# EAGLE design OLED_096_SH1101A_main (EAGLE 6.0)

## Sheet 1 of 2
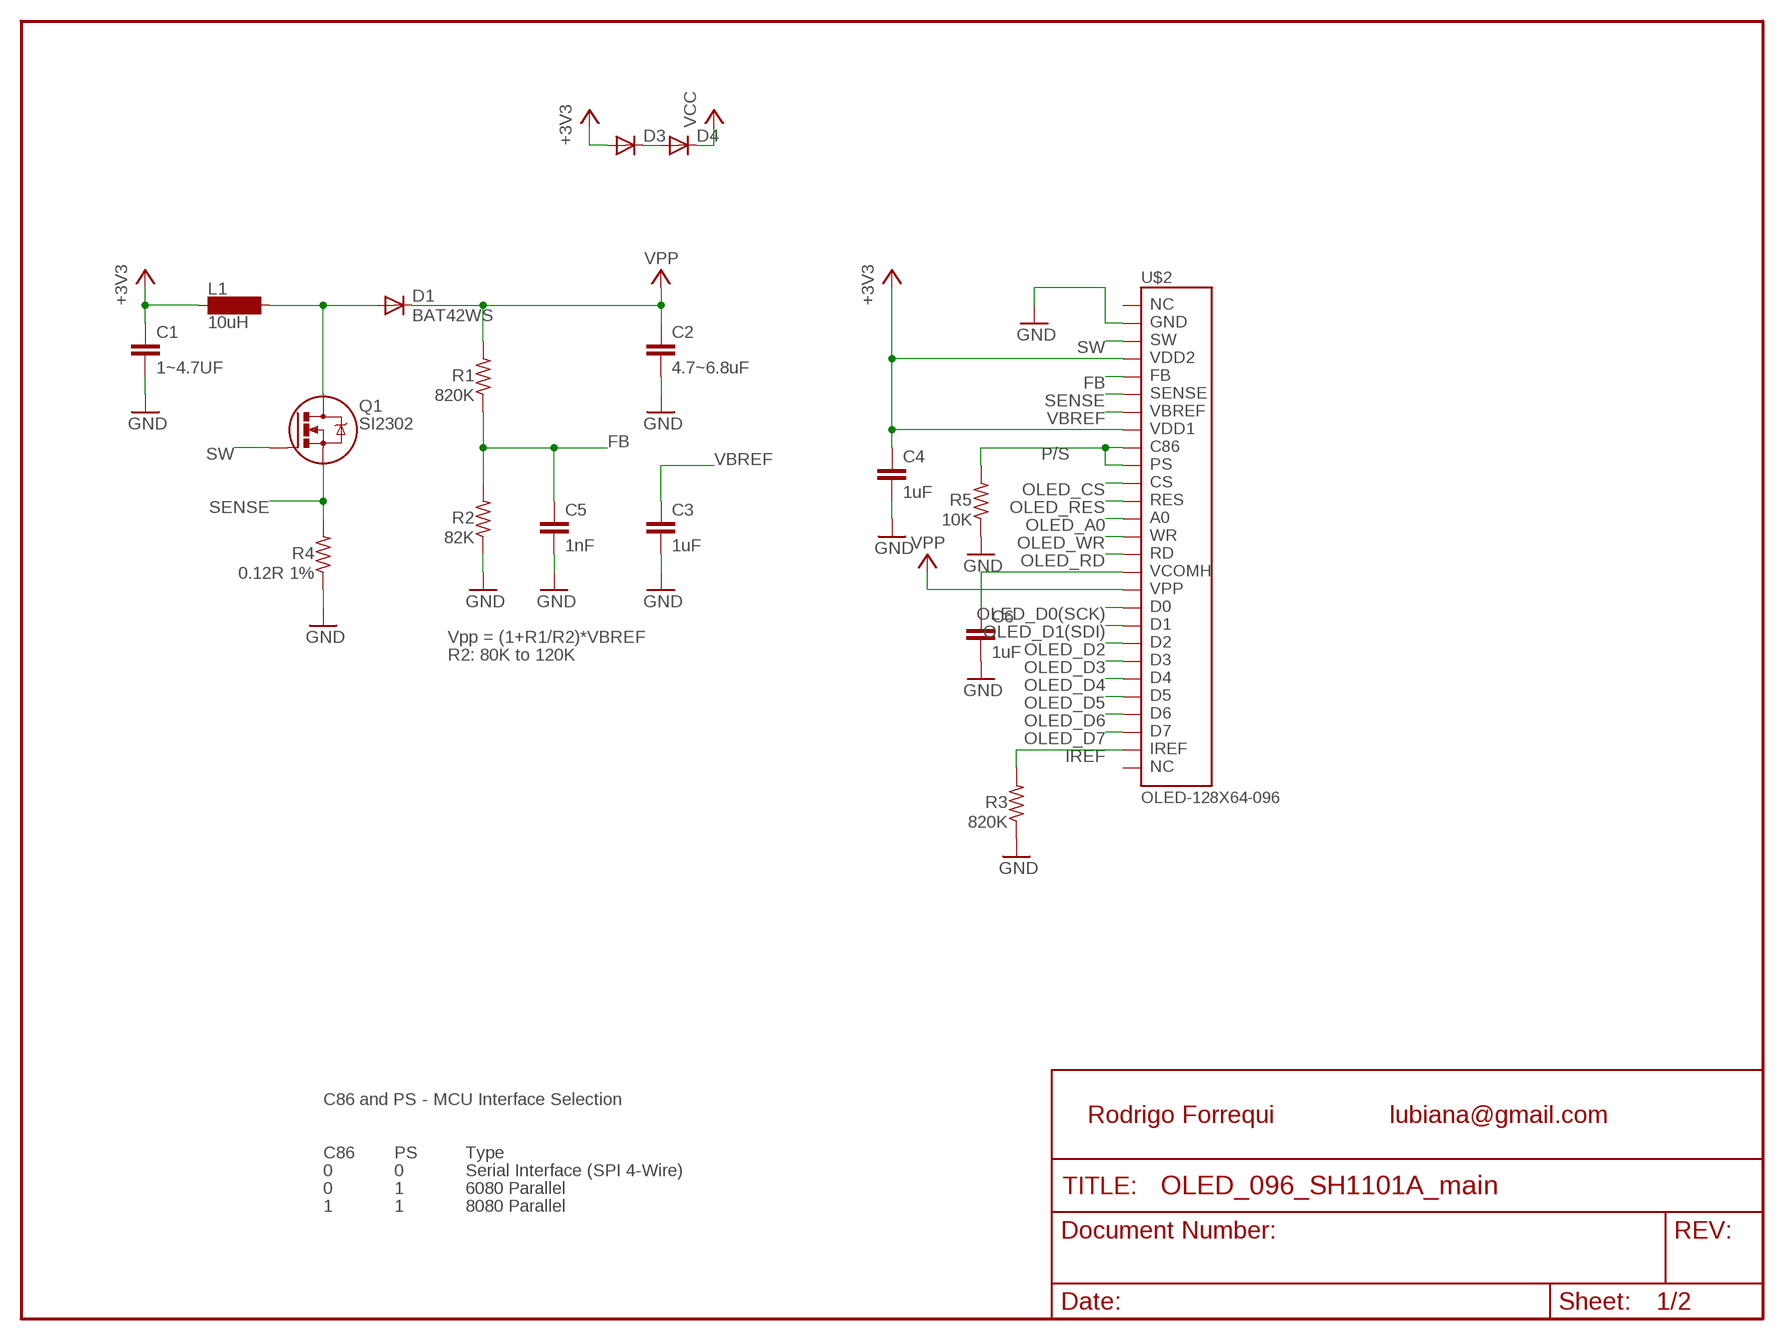
[diagram p0: schematic, sheet 1]

### Parts
C1  1~4.7UF  C-EUC0805  [C0805]
C2  4.7~6.8uF  C-EUC0805  [C0805]
C3  1uF  C-EUC0805  [C0805]
C4  1uF  C-EUC0805  [C0805]
C5  1nF  C-EUC0805  [C0805]
C6  1uF  C-EUC0805  [C0805]
D1  BAT42WS  DIODESOD  [SOD-323]
D3  DIODE-MINIMELF  [MINIMELF]
D4  DIODE-MINIMELF  [MINIMELF]
L1  10uH  LPO4812  [LPO4812]
Q1  SI2302  MOSFET-NCHANNELSMD  [SOT23-3]
R1  820K  R-US_R0805  [R0805]
R2  82K  R-US_R0805  [R0805]
R3  820K  R-US_R0805  [R0805]
R4  0.12R 1%  R-US_M1206  [M1206]
R5  10K  R-US_R0805  [R0805]
U$2  OLED-128X64-096  [UG-2864AMBAG01]

### Nets
+3V3: C1.1 C4.1 D3.A L1.P$1 U$2.P$4 U$2.P$8
FB: C5.1 R1.1 R2.2 U$2.P$5
GND: C1.2 C2.2 C3.2 C4.2 C5.2 C6.2 R2.1 R3.1 R4.1 R5.1 U$2.P$2 ; also sheet 2
IREF: R3.2 U$2.P$26
N$2: D1.2(A) L1.P$2 Q1.3(D)
N$3: C6.1 U$2.P$16
N$15: D3.C D4.A
OLED_A0: U$2.P$13 ; also sheet 2
OLED_CS: U$2.P$11 ; also sheet 2
OLED_D0(SCK): U$2.P$18 ; also sheet 2
OLED_D1(SDI): U$2.P$19 ; also sheet 2
OLED_D2: U$2.P$20
OLED_D3: U$2.P$21
OLED_D4: U$2.P$22
OLED_D5: U$2.P$23
OLED_D6: U$2.P$24
OLED_D7: U$2.P$25
OLED_RD: U$2.P$15
OLED_RES: U$2.P$12 ; also sheet 2
OLED_WR: U$2.P$14
P/S: R5.2 U$2.P$9 U$2.P$10
SENSE: Q1.2(S) R4.2 U$2.P$6
SW: Q1.1(G) U$2.P$3
VBREF: C3.1 U$2.P$7
VCC: C2.1 D1.1(C) D4.C R1.2 U$2.P$17 ; supply symbol labelled VPP ; also sheet 2
Unconnected: U$2.P$1 U$2.P$27

### Notes on the sheet
- Vpp = (1+R1/R2)*VBREF
- R2: 80K to 120K
- C86 and PS - MCU Interface Selection
- Rodrigo Forrequi | lubiana@gmail.com
- C86 | PS | Type
- 0 | 0 | Serial Interface (SPI 4-Wire)
- 0 | 1 | 6080 Parallel
- 1 | 1 | 8080 Parallel

## Sheet 2 of 2
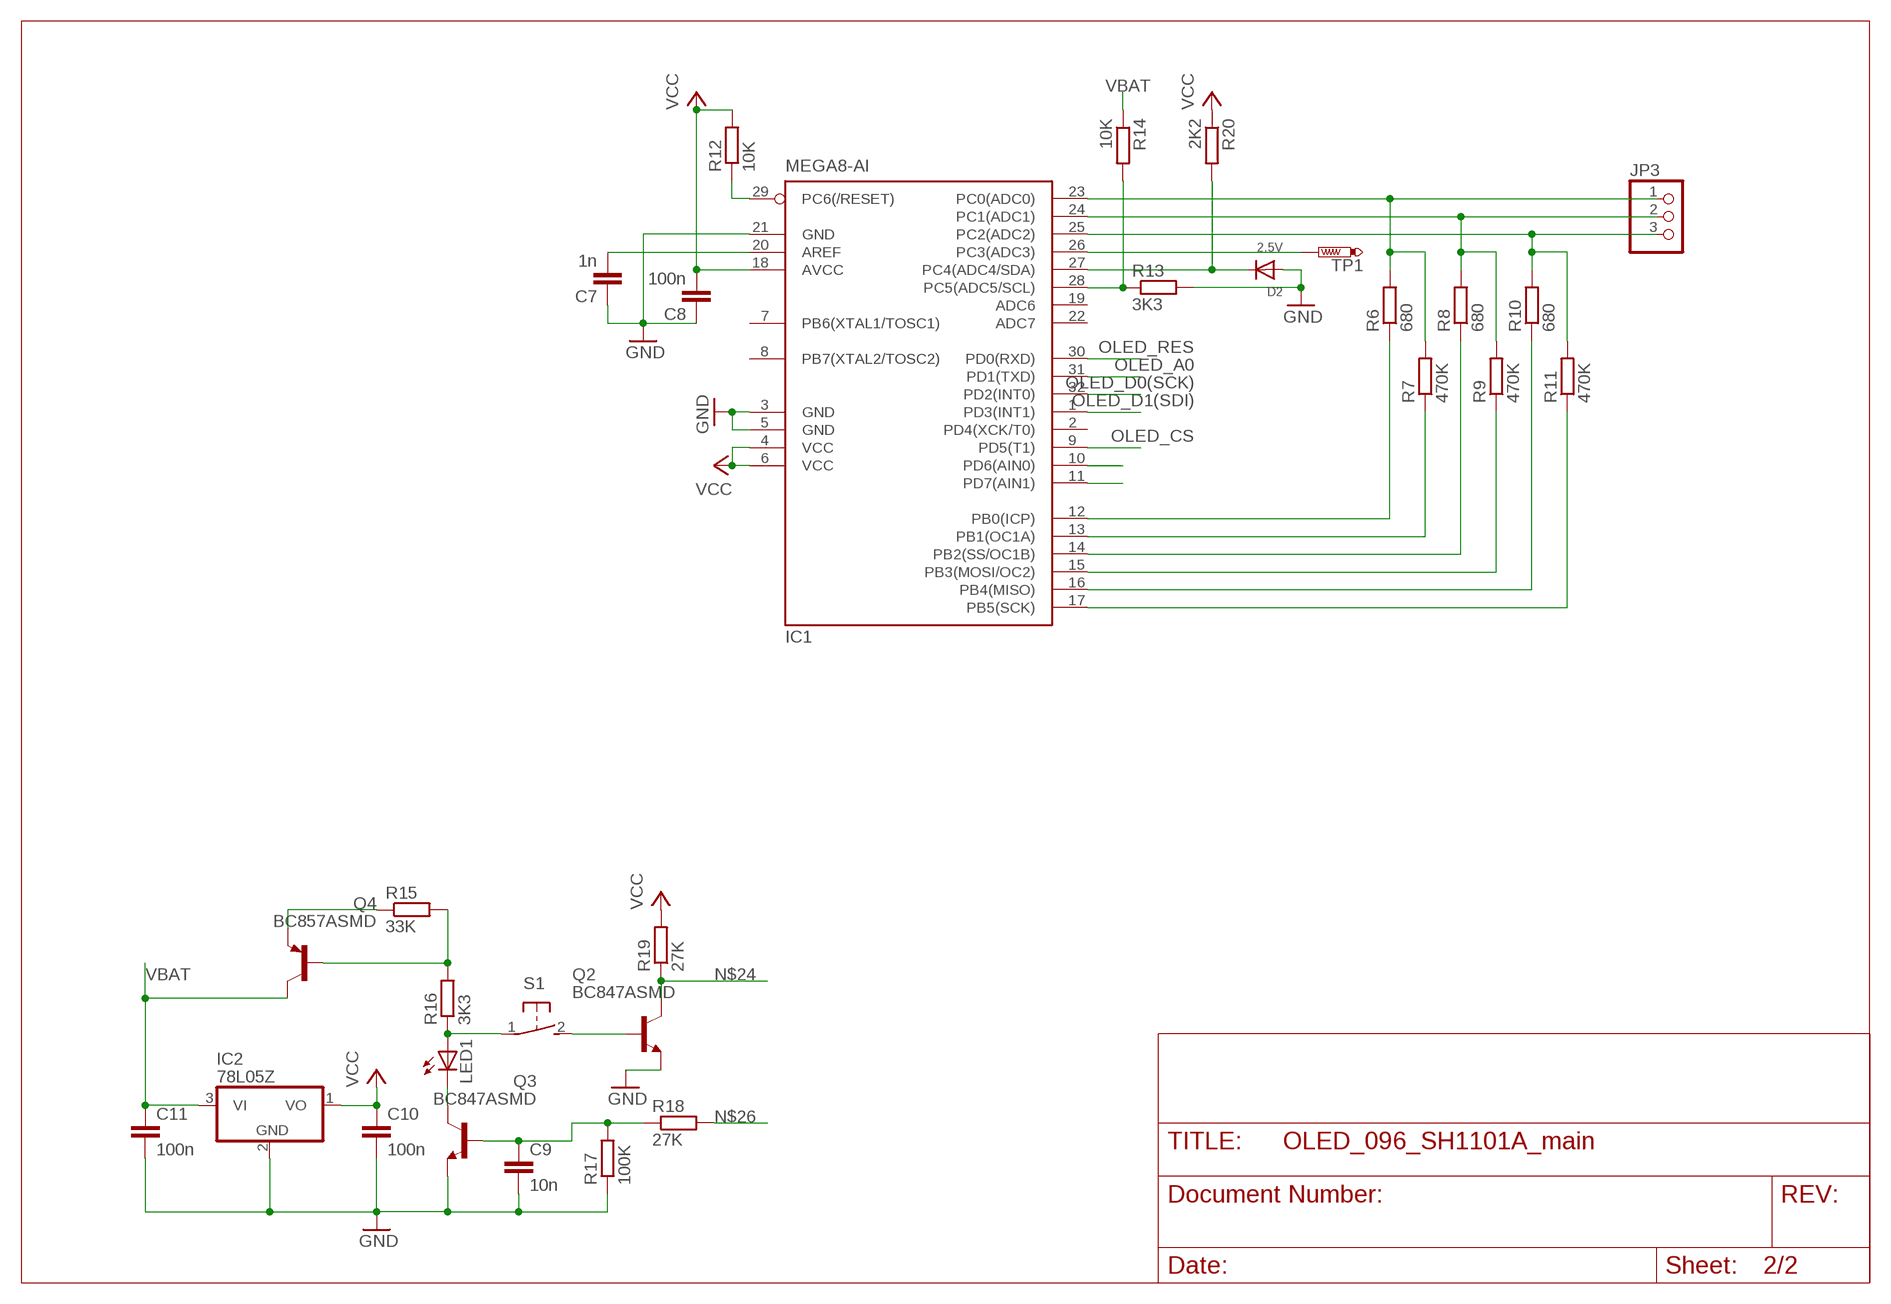
[diagram p1: schematic, sheet 2]

### Parts
C7  1n  C-EUC0805  [C0805]
C8  100n  C-EUC0805  [C0805]
C9  10n  C-EUC0805  [C0805]
C10  100n  C-EUC0805  [C0805]
C11  100n  C-EUC0805  [C0805]
D2  2.5V  DIODESOD-523  [SOD-523]
IC1  MEGA8-AI  [TQFP32-08]
IC2  78L05Z  [TO92]
JP3  PINHD-1X3  [1X03]
LED1  LEDSML0603  [SML0603]
Q2  BC847ASMD  [SOT23]
Q3  BC847ASMD  [SOT23]
Q4  BC857ASMD  [SOT23-BEC]
R6  680  R-EU_R0805  [R0805]
R7  470K  R-EU_R0805  [R0805]
R8  680  R-EU_R0805  [R0805]
R9  470K  R-EU_R0805  [R0805]
R10  680  R-EU_R0805  [R0805]
R11  470K  R-EU_R0805  [R0805]
R12  10K  R-EU_R0805  [R0805]
R13  3K3  R-EU_R0805  [R0805]
R14  10K  R-EU_R0805  [R0805]
R15  33K  R-EU_R0805  [R0805]
R16  3K3  R-EU_R0805  [R0805]
R17  100K  R-EU_R0805  [R0805]
R18  27K  R-EU_R0805  [R0805]
R19  27K  R-EU_R0805  [R0805]
R20  2K2  R-EU_R0805  [R0805]
S1  31-XX  [B3F-31XX]
TP1  PTR1B1,27  [B1,27]

### Nets
GND: C7.1 C8.1 C9.2 C10.2 C11.2 D2.A IC1.3(GND) IC1.5(GND) IC1.21(GND) IC2.2(GND) Q2.2(E) Q3.2(E) R13.2 R17.1 ; also sheet 1
N$1: IC1.23(PC0(ADC0)) JP3.1 R6.2 R7.2
N$4: IC1.24(PC1(ADC1)) JP3.2 R8.2 R9.2
N$5: IC1.25(PC2(ADC2)) JP3.3 R10.2 R11.2
N$6: IC1.12(PB0(ICP)) R6.1
N$7: IC1.13(PB1(OC1A)) R7.1
N$8: IC1.14(PB2(SS/OC1B)) R8.1
N$9: IC1.15(PB3(MOSI/OC2)) R9.1
N$10: IC1.16(PB4(MISO)) R10.1
N$11: IC1.17(PB5(SCK)) R11.1
N$12: C7.2 IC1.20(AREF)
N$13: IC1.28(PC5(ADC5/SCL)) R13.1 R14.2
N$14: IC1.29(PC6(/RESET)) R12.1
N$16: D2.K(C) IC1.27(PC4(ADC4/SDA)) R20.2
N$17: IC1.26(PC3(ADC3)) TP1.TP
N$18: C9.1 Q3.1(B) R17.2 R18.1
N$19: LED1.A R16.1 S1.1(P)
N$20: LED1.C Q3.3(C)
N$21: Q2.1(B) S1.2(S)
N$22: Q4.B R15.2 R16.2
N$23: Q4.E R15.1
N$24: IC1.11(PD7(AIN1)) Q2.3(C) R19.1
N$26: IC1.10(PD6(AIN0)) R18.2
OLED_A0: IC1.31(PD1(TXD)) ; also sheet 1
OLED_CS: IC1.9(PD5(T1)) ; also sheet 1
OLED_D0(SCK): IC1.32(PD2(INT0)) ; also sheet 1
OLED_D1(SDI): IC1.1(PD3(INT1)) ; also sheet 1
OLED_RES: IC1.30(PD0(RXD)) ; also sheet 1
VBAT: C11.1 IC2.3(VI) Q4.C R14.1
VCC: C8.2 C10.1 IC1.4(VCC) IC1.6(VCC) IC1.18(AVCC) IC2.1(VO) R12.2 R19.2 R20.1 ; also sheet 1
Unconnected: IC1.2(PD4(XCK/T0)) IC1.7(PB6(XTAL1/TOSC1)) IC1.8(PB7(XTAL2/TOSC2)) IC1.19(ADC6) IC1.22(ADC7)

## Library data of the parts
C1-C6 = rcl:C-EU: CAPACITOR, European symbol
C7-C11 = resistor:C-EU: CAPACITOR, European symbol
D1 = Forrequi:DIODE: Diode
D2 = adafruit:DIODE: Diode
D3 D4 = diode:DIODE-: DIODE
IC1 = atmel:MEGA8: MICROCONTROLLER 8 Kbytes FLASH, 1 kbytes SRAM, 512 bytes EEPROM, USART, 6-channel 10 bit ADC, 2-channel 8 bit ADC Pin compatible with Atmega48, ATMega88, ATMega168 Source: avr.lbr; MPN: ATMEGA8-16AU; OC_FARNELL: 9171371; OC_NEWARK: 73M8863
IC2 = linear:78*: Positive VOLTAGE REGULATOR Source: http://cache.national.com/ds/LM/LM78L05.pdf http://www.fairchildsemi.com/ds/LM/LM7805.pdf
JP3 = pinhead:PINHD-1X3: PIN HEADER
L1 = Forrequi:LPO4812: Coilcraft inductor LPO4812 Datasheet and info at: http://www.coilcraft.com/lpo4812.cfm
LED1 = led:LED: LED OSRAM: - CHIPLED LG R971, LG N971, LY N971, LG Q971, LY Q971, LO R971, LY R971 LH N974, LH R974 LS Q976, LO Q976, LY Q976 LO Q996 - Hyper CHIPLED LW Q18S LB Q993, LB Q99A, LB R99A - SideLED LS A670, LO A670, LY A670, LG A670, LP A670 LB A673, LV A673, LT A673, LW A673 LH A674 LY A675 LS A676, LA A676, LO A676, LY A676, LW A676 LS A679, LY A679, LG A679 - Hyper Micro SIDELED® LS Y876, LA Y876, LO Y876, LY Y876 LT Y87S - SmartLED LW L88C, LW L88S LB L89C, LB L89S, LG L890 LS L89K, LO L89K, LY L89K LS L896, LA L896, LO L896, LY L896 - TOPLED LS T670, LO T670, LY T670, LG T670, LP T670 LSG T670, LSP T670, LSY T670, LOP T670, LYG T670 LG T671, LOG T671, LSG T671 LB T673, LV T673, LT T673, LW T673 LH T674 LS T676, LA T676, LO T676, LY T676, LB T676, LH T676, LSB T676, LW T676 LB T67C, LV T67C, LT T67C, LS T67K, LO T67K, LY T67K, LW E67C LS E67B, LA E67B, LO E67B, LY E67B, LB E67C, LV E67C, LT E67C LW T67C LS T679, LY T679, LG T679 LS T770, LO T770, LY T770, LG T770, LP T770 LB T773, LV T773, LT T773, LW T773 LH T774 LS E675, LA E675, LY E675, LS T675 LS T776, LA T776, LO T776, LY T776, LB T776 LHGB T686 LT T68C, LB T68C - Hyper Mini TOPLED® LB M676 - Mini TOPLED Santana® LG M470 LS M47K, LO M47K, LY M47K Source: http://www.osram.convergy.de LUXEON: - LUMILED® LXK2-PW12-R00, LXK2-PW12-S00, LXK2-PW14-U00, LXK2-PW14-V00 LXK2-PM12-R00, LXK2-PM12-S00, LXK2-PM14-U00 LXK2-PE12-Q00, LXK2-PE12-R00, LXK2-PE12-S00, LXK2-PE14-T00, LXK2-PE14-U00 LXK2-PB12-K00, LXK2-PB12-L00, LXK2-PB12-M00, LXK2-PB14-N00, LXK2-PB14-P00, LXK2-PB14-Q00 LXK2-PR12-L00, LXK2-PR12-M00, LXK2-PR14-Q00, LXK2-PR14-R00 LXK2-PD12-Q00, LXK2-PD12-R00, LXK2-PD12-S00 LXK2-PH12-R00, LXK2-PH12-S00 LXK2-PL12-P00, LXK2-PL12-Q00, LXK2-PL12-R00 Source: www.luxeon.com KINGBRIGHT: KA-3528ASYC Source: www.kingbright.com
Q1 = Forrequi:MOSFET-NCHANNEL
Q2 Q3 = transistor-npn:BC847*: NPN Transistor
Q4 = transistor-pnp:BC857*: PNP Transistror
R1-R5 = rcl:R-US_: RESISTOR, American symbol
R6-R20 = resistor:R-EU_: RESISTOR, European symbol
S1 = switch-omron:31-XX: OMRON SWITCH; MPN: B3F-3100; OC_FARNELL: 959704; OC_NEWARK: 36M3582
TP1 = testpad:PTR1: TEST PIN
U$2 = Forrequi:OLED-128X64-096

## Board
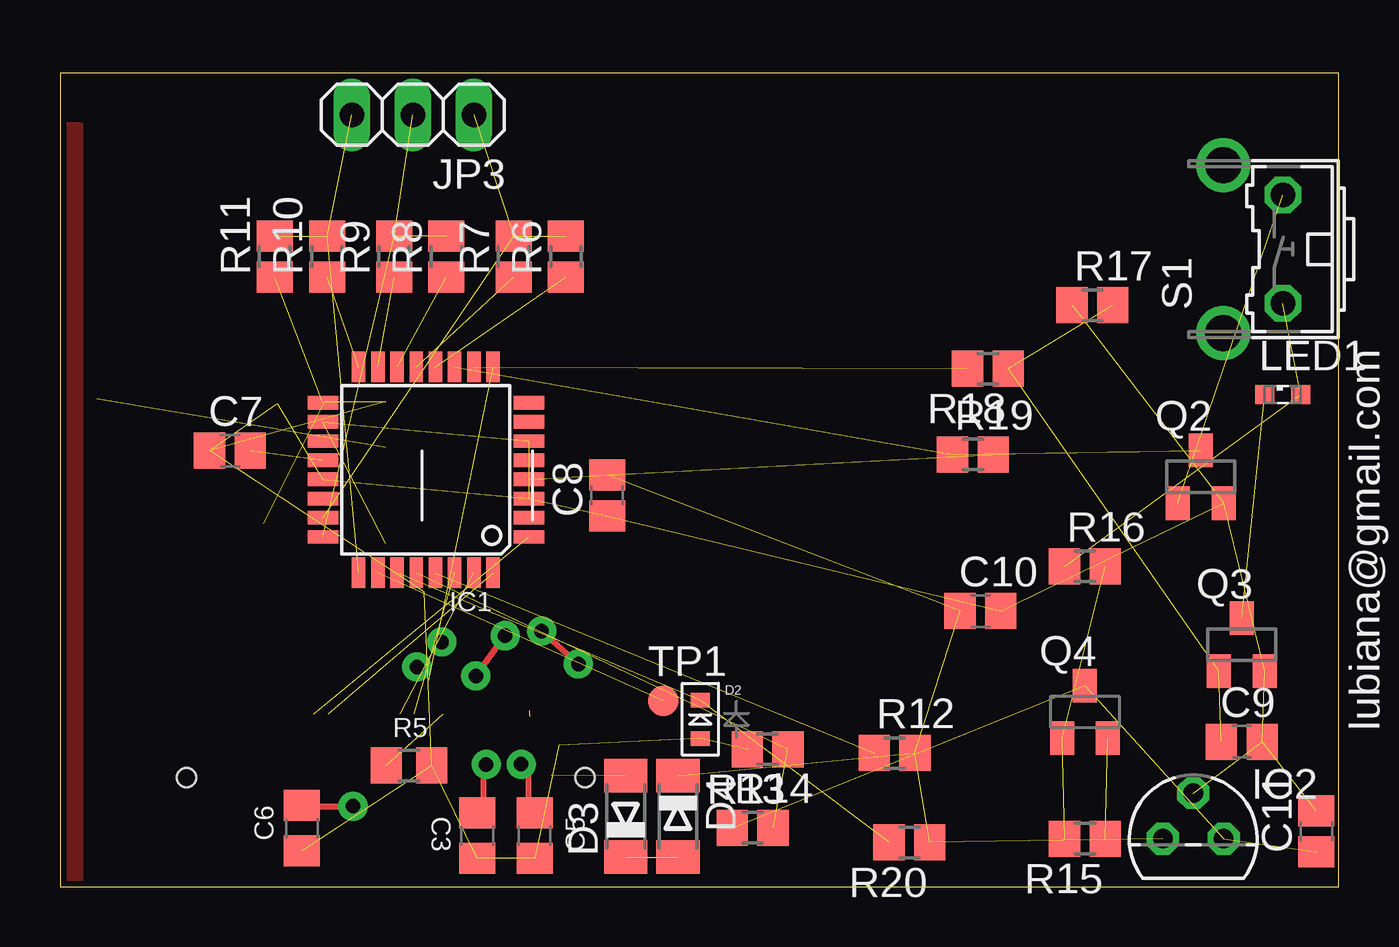
[diagram p2: board, top side]
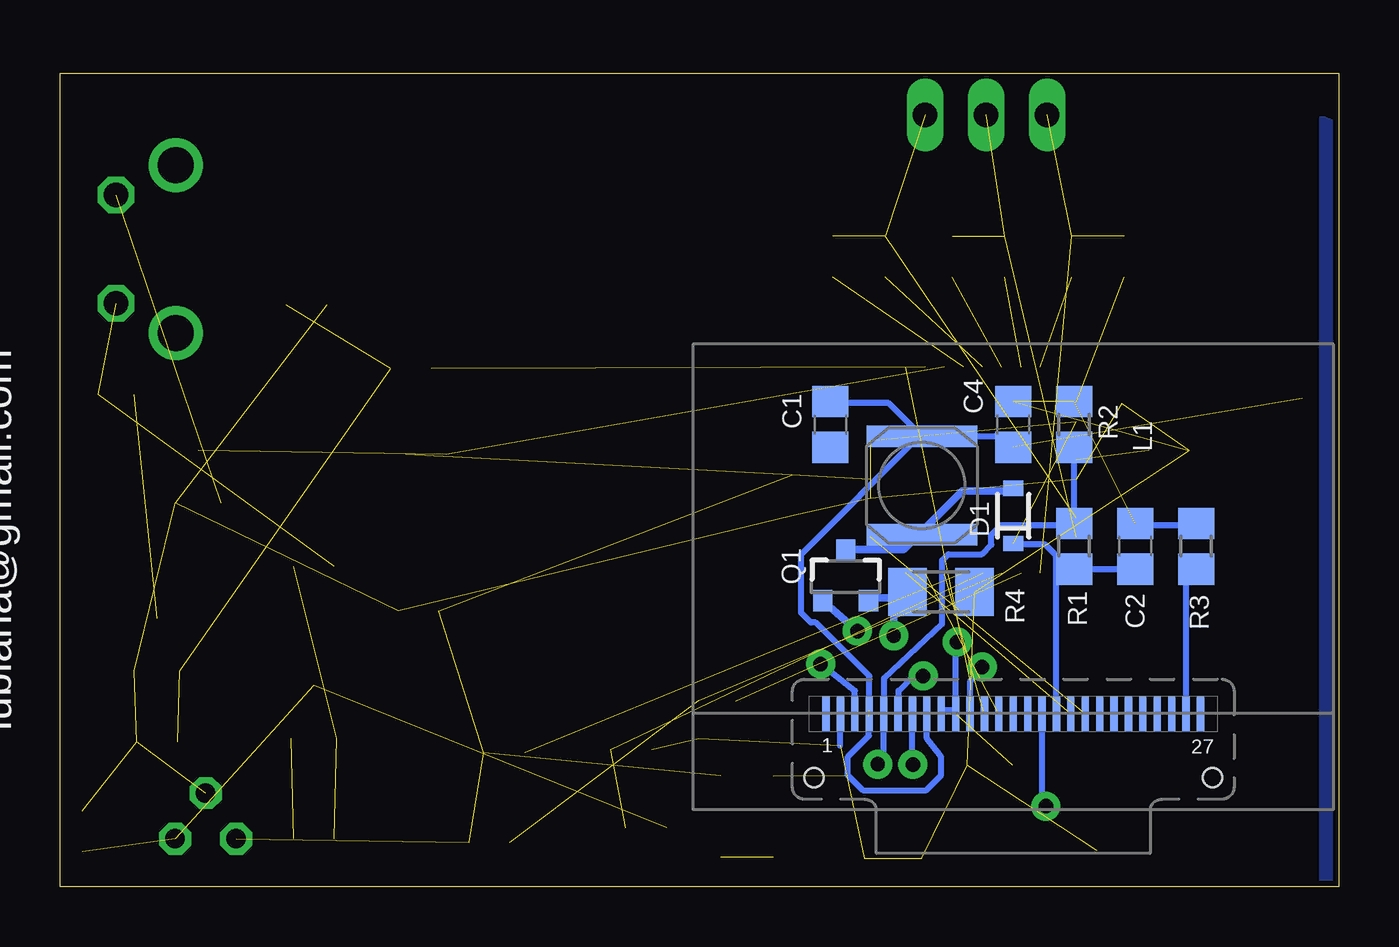
[diagram p3: board, bottom side, seen from below]

Size 53.29 x 33.92 mm. Coordinates in mm from the lower left corner, seen from the top.
Outline: 0,33.92 0,0 53.29,0 53.29,33.92 0,33.92
Copper layers (1*16): Top 0.035mm / dielectric 1.5mm / Bottom 0.035mm
Design rules: minimum track width 10mil, minimum drill 23mil, track to track 8mil, track to pad 8mil, pad to pad 8mil, via to via 8mil, smd to smd 8mil, copper to edge 8mil, drill to drill 10mil, minimum pad ring 10mil, minimum via ring 12mil, stop-mask expansion 4mil, vias tented up to drill 0mil, thermal gap 10mil

### Footprints (pad centres in the part's own frame; a part is rotated, then mirrored left to right if it is on the bottom)
C0805 = smd 1.3 x 1.5: 1 -0.95,0; 2 0.95,0
C0805' = smd 1.3 x 1.5: 1 -0.85,0; 2 0.85,0
SOD-323 = smd 0.63 x 0.83: 1 -1.15,0; 2 1.15,0
SOD-523 = smd 0.8 x 0.6: A 0,-0.8; K 0,0.8
MINIMELF = smd 1.4 x 1.8: A 1.7,0; C -1.7,0
TQFP32-08 = smd 1.27 x 0.559: 1 -4.293,2.8; 2 -4.293,2; 3 -4.293,1.2; 4 -4.293,0.4; 5 -4.293,-0.4; 6 -4.293,-1.2; 7 -4.293,-2; 8 -4.293,-2.8; 17 4.293,-2.8; 18 4.293,-2; 19 4.293,-1.2; 20 4.293,-0.4; 21 4.293,0.4; 22 4.293,1.2; 23 4.293,2; 24 4.293,2.8 | smd 0.559 x 1.27: 9 -2.8,-4.293; 10 -2,-4.293; 11 -1.2,-4.293; 12 -0.4,-4.293; 13 0.4,-4.293; 14 1.2,-4.293; 15 2,-4.293; 16 2.8,-4.293; 25 2.8,4.293; 26 2,4.293; 27 1.2,4.293; 28 0.4,4.293; 29 -0.4,4.293; 30 -1.2,4.293; 31 -2,4.293; 32 -2.8,4.293
TO92 = drill 0.813 octagon: 1 -1.27,0; 2 0,1.905; 3 1.27,0
1X03 = drill 1.016 long: 1 -2.54,0; 2 0,0; 3 2.54,0
LPO4812 = smd 4.6 x 0.89: P$1 0,2.05; P$2 0,-2.05
SML0603 = smd 0.8 x 0.8: A 0.75,0; C -0.75,0
SOT23-3 = smd 0.8 x 0.9: 1 -0.95,-1; 2 0.95,-1; 3 0,1.1
SOT23 = smd 1 x 1.4: 1 -0.95,-1.1; 2 0.95,-1.1; 3 0,1.1
SOT23-BEC = smd 1 x 1.4: B -0.95,-1.1; C 0,1.1; E 0.95,-1.1
R0805 = smd 1.3 x 1.5: 1 -0.95,0; 2 0.95,0
M1206 = smd 1.6 x 2: 1 -1.4,0; 2 1.4,0
R0805' = smd 1.3 x 1.5: 1 -0.85,0; 2 0.85,0
B3F-31XX = drill 1.016 octagon: 1 -2.261,-1.245; 2 2.261,-1.245 | drill 1.499 pad 2.159: 3 -3.505,1.245; 4 3.505,1.245
B1,27 = smd 1.27 x 1.27: TP 0,0
UG-2864AMBAG01 = smd 0.3 x 1.5: P$1 -7.8,-5.72; P$2 -7.2,-5.72; P$3 -6.6,-5.72; P$4 -6,-5.72; P$5 -5.4,-5.72; P$6 -4.8,-5.72; P$7 -4.2,-5.72; P$8 -3.6,-5.72; P$9 -3,-5.72; P$10 -2.4,-5.72; P$11 -1.8,-5.72; P$12 -1.2,-5.72; P$13 -0.6,-5.72; P$14 0,-5.72; P$15 0.6,-5.72; P$16 1.2,-5.72; P$17 1.8,-5.72; P$18 2.4,-5.72; P$19 3,-5.72; P$20 3.6,-5.72; P$21 4.2,-5.72; P$22 4.8,-5.72; P$23 5.4,-5.72; P$24 6,-5.72; P$25 6.6,-5.72; P$26 7.2,-5.72; P$27 7.8,-5.72 | hole 0.8: 8.3,-8.37; -8.3,-8.37

### Placement (x,y rotation side)
C1  21.19,19.28 270 bottom
C2  8.49,14.2 90 bottom
C3  17.39,2.14 270 top
C4  13.57,19.28 90 bottom
C5  19.78,2.14 270 top
C6  10.08,2.45 270 top
C7  1n  [C0805']  7.08,18.19 0 top
C8  100n  [C0805']  22.79,16.32 90 top
C9  10n  [C0805']  49.24,6.05 0 top
C10  100n  [C0805']  38.35,11.5 0 top
C11  100n  [C0805']  52.35,2.32 90 top
D1  13.57,15.47 90 bottom
D2  26.68,6.99 0 top
D3  23.57,2.94 90 top
D4  25.75,2.94 270 top
IC1  15.24,17.39 180 top
IC2  47.22,2.01 0 top
JP3  14.7,32.19 180 top
L1  17.38,16.74 0 bottom
LED1  50.95,20.52 0 top
Q1  20.55,12.93 0 bottom
Q2  47.53,17.1 0 top
Q3  49.24,10.1 0 top
Q4  42.71,7.3 0 top
R1  11.03,14.2 270 bottom
R2  11.03,19.28 270 bottom
R3  5.95,14.2 270 bottom
R4  16.58,12.3 180 bottom
R5  14.54,5.07 180 top
R6  680  [R0805']  21.08,26.28 90 top
R7  470K  [R0805']  18.9,26.28 90 top
R8  680  [R0805']  16.1,26.28 90 top
R9  470K  [R0805']  13.93,26.28 90 top
R10  680  [R0805']  11.13,26.28 90 top
R11  470K  [R0805']  8.95,26.28 90 top
R12  10K  [R0805']  34.77,5.59 0 top
R13  3K3  [R0805']  29.48,5.74 180 top
R14  10K  [R0805']  28.86,2.48 0 top
R15  33K  [R0805']  42.71,2.01 180 top
R16  3K3  [R0805']  42.71,13.37 0 top
R17  100K  [R0805']  43.02,24.26 0 top
R18  27K  [R0805']  38.66,21.61 180 top
R19  27K  [R0805']  38.04,18.03 0 top
R20  2K2  [R0805']  35.39,1.85 180 top
S1  49.71,26.59 90 top
TP1  25.13,7.77 0 top
U$2  13.57,12.93 0 bottom

### Tracks (layer width: path | path; a pad name or v marks a point on that pad's centre or on a via)
+3V3  (4 unrouted)
  Bottom 0.254: L1.P$1 17.33,18.75 | C1.1 21.19,20.17 18.75,20.17 17.53,18.95 L1.P$1 | 19.56,7.37 19.56,8.79 21.8,11.03 22,11.03 22.41,11.43 22.41,13.87 17.53,18.75 L1.P$1 | 13.67,18.34 14.12,18.79 L1.P$1 | 17.19,6.79 U$2.P$8 17.17,6.19 16.57,5.43 16.57,4.65 17.19,4.03 19.84,4.03 20.46,4.65 20.46,5.43 19.59,6.3 19.59,7.1
FB  (via drill 0.6)
  Top 0.254: v19.21,5.12 19.53,4.81 19.53,3.1 19.68,2.94 C5.1
  Bottom 0.254: R2.2 R1.1 11.03,15.09 14.08,15.09 14.48,14.68 14.48,14.28 14.89,13.87 16.28,13.87 16.53,13.62 16.53,10.97 18.95,8.7 18.95,7.23 U$2.P$5 18.97,5.37 v19.21,5.12
GND  (23 unrouted)
  Bottom 0.254: C2.2 8.39,15.09 5.95,15.09 R3.1 | 21.19,18.34 C1.2 21.19,18.14 | 20.78,5.9 20.78,7.17 U$2.P$2
  pour Bottom (isolate 0.254): 0,31.74 0.71,32.05 0.71,-0.02 0,-0.33
  pour Top (isolate 0.254): 0,-0.01 0.87,-0.01 0.87,31.74 0,31.74
IREF
  Bottom 0.254: U$2.P$26 6.36,7.37 6.36,12.65 5.95,13.06 R3.2
N$1  (3 unrouted)
N$2
  Bottom 0.254: 13.67,16.51 D1.2 | 17.33,14.89 L1.P$2 17.53,14.68 | Q1.3 20.38,14.07
  Bottom 0.305: 13.67,16.51 15.7,16.51 17.33,14.89 | 20.38,14.07 18.14,14.07 17.53,14.68
N$3  (via drill 0.6)
  Top 0.254: C6.1 10.08,3.52 10.23,3.37 v12.21,3.37
  Bottom 0.25: U$2.P$16 12.37,3.53 v12.21,3.37
  Bottom 0.254: U$2.P$16
N$4  (3 unrouted)
N$5  (3 unrouted)
N$6  (1 unrouted)
N$7  (1 unrouted)
N$8  (1 unrouted)
N$9  (1 unrouted)
N$10  (1 unrouted)
N$11  (1 unrouted)
N$12  (1 unrouted)
N$13  (2 unrouted)
N$14  (1 unrouted)
N$15  (1 unrouted)
N$16  (2 unrouted)
N$17  (1 unrouted)
N$18  (3 unrouted)
N$19  (2 unrouted)
N$20  (1 unrouted)
N$21  (1 unrouted)
N$22  (2 unrouted)
N$23  (1 unrouted)
N$24  (2 unrouted)
N$26  (1 unrouted)
OLED_A0  (1 unrouted)
OLED_CS  (via drill 0.6)  (1 unrouted)
  Top 0.254: v14.87,9.17 14.84,9.2
  Bottom 0.254: v14.87,9.17 15.36,8.59 15.36,7.37 U$2.P$11
OLED_D0(SCK)  (1 unrouted)
  Bottom 0.254: U$2.P$18 11.17,7.23
OLED_D1(SDI)  (1 unrouted)
  Bottom 0.254: U$2.P$19 10.56,7.23
OLED_RES  (1 unrouted)
P/S  (via drill 0.6)  (1 unrouted)
  Bottom 0.254: U$2.P$9 16.52,7.37 16.11,7.37 U$2.P$10 15.97,10.15 v15.91,10.21
SENSE  (via drill 0.6)
  Top 0.254: v17.33,8.79 v18.55,10.48
  Bottom 0.254: 17.74,12.04 17.53,12.25 R4.2 | 19.56,12.04 Q1.2 | v17.33,8.79 17.74,8.79 18.34,8.18 18.34,7.37 U$2.P$6
  Bottom 0.305: 18.55,12.04 17.74,12.04 | 18.55,12.04 19.56,12.04 | v18.55,10.48 18.55,12.04
SW  (via drill 0.6)
  Top 0.254: v21.6,9.29 v20.07,10.67
  Bottom 0.254: v21.6,9.29 20.17,8.18 20.17,7.37 U$2.P$3 | 21.39,11.84 Q1.1
  Bottom 0.305: v20.07,10.67 21.39,11.84
VBAT  (3 unrouted)
VBREF  (via drill 0.6)
  Top 0.254: v17.75,5.11 17.66,4.97 17.66,3.1 17.5,2.94 C3.1
  Bottom 0.254: v17.75,5.11 17.77,5.13 U$2.P$7
VCC  (10 unrouted)
  Bottom 0.254: D1.1 13.47,14.28 12.24,14.28 11.78,13.82 11.78,13.21 | 11.78,13.21 11.78,7.37 U$2.P$17 | C2.1 8.59,13.26 11.03,13.26 R1.2 11.12,13.21 11.78,13.21

### Text on the board
tPlace: OLED 0.96" Board | lubiana@gmail.com | C3
bPlace: Rodrigo Forrequi | lubiana@gmail.com